# EAGLE design LTC6811_slave_12s_rev2 (EAGLE 9.3.1)
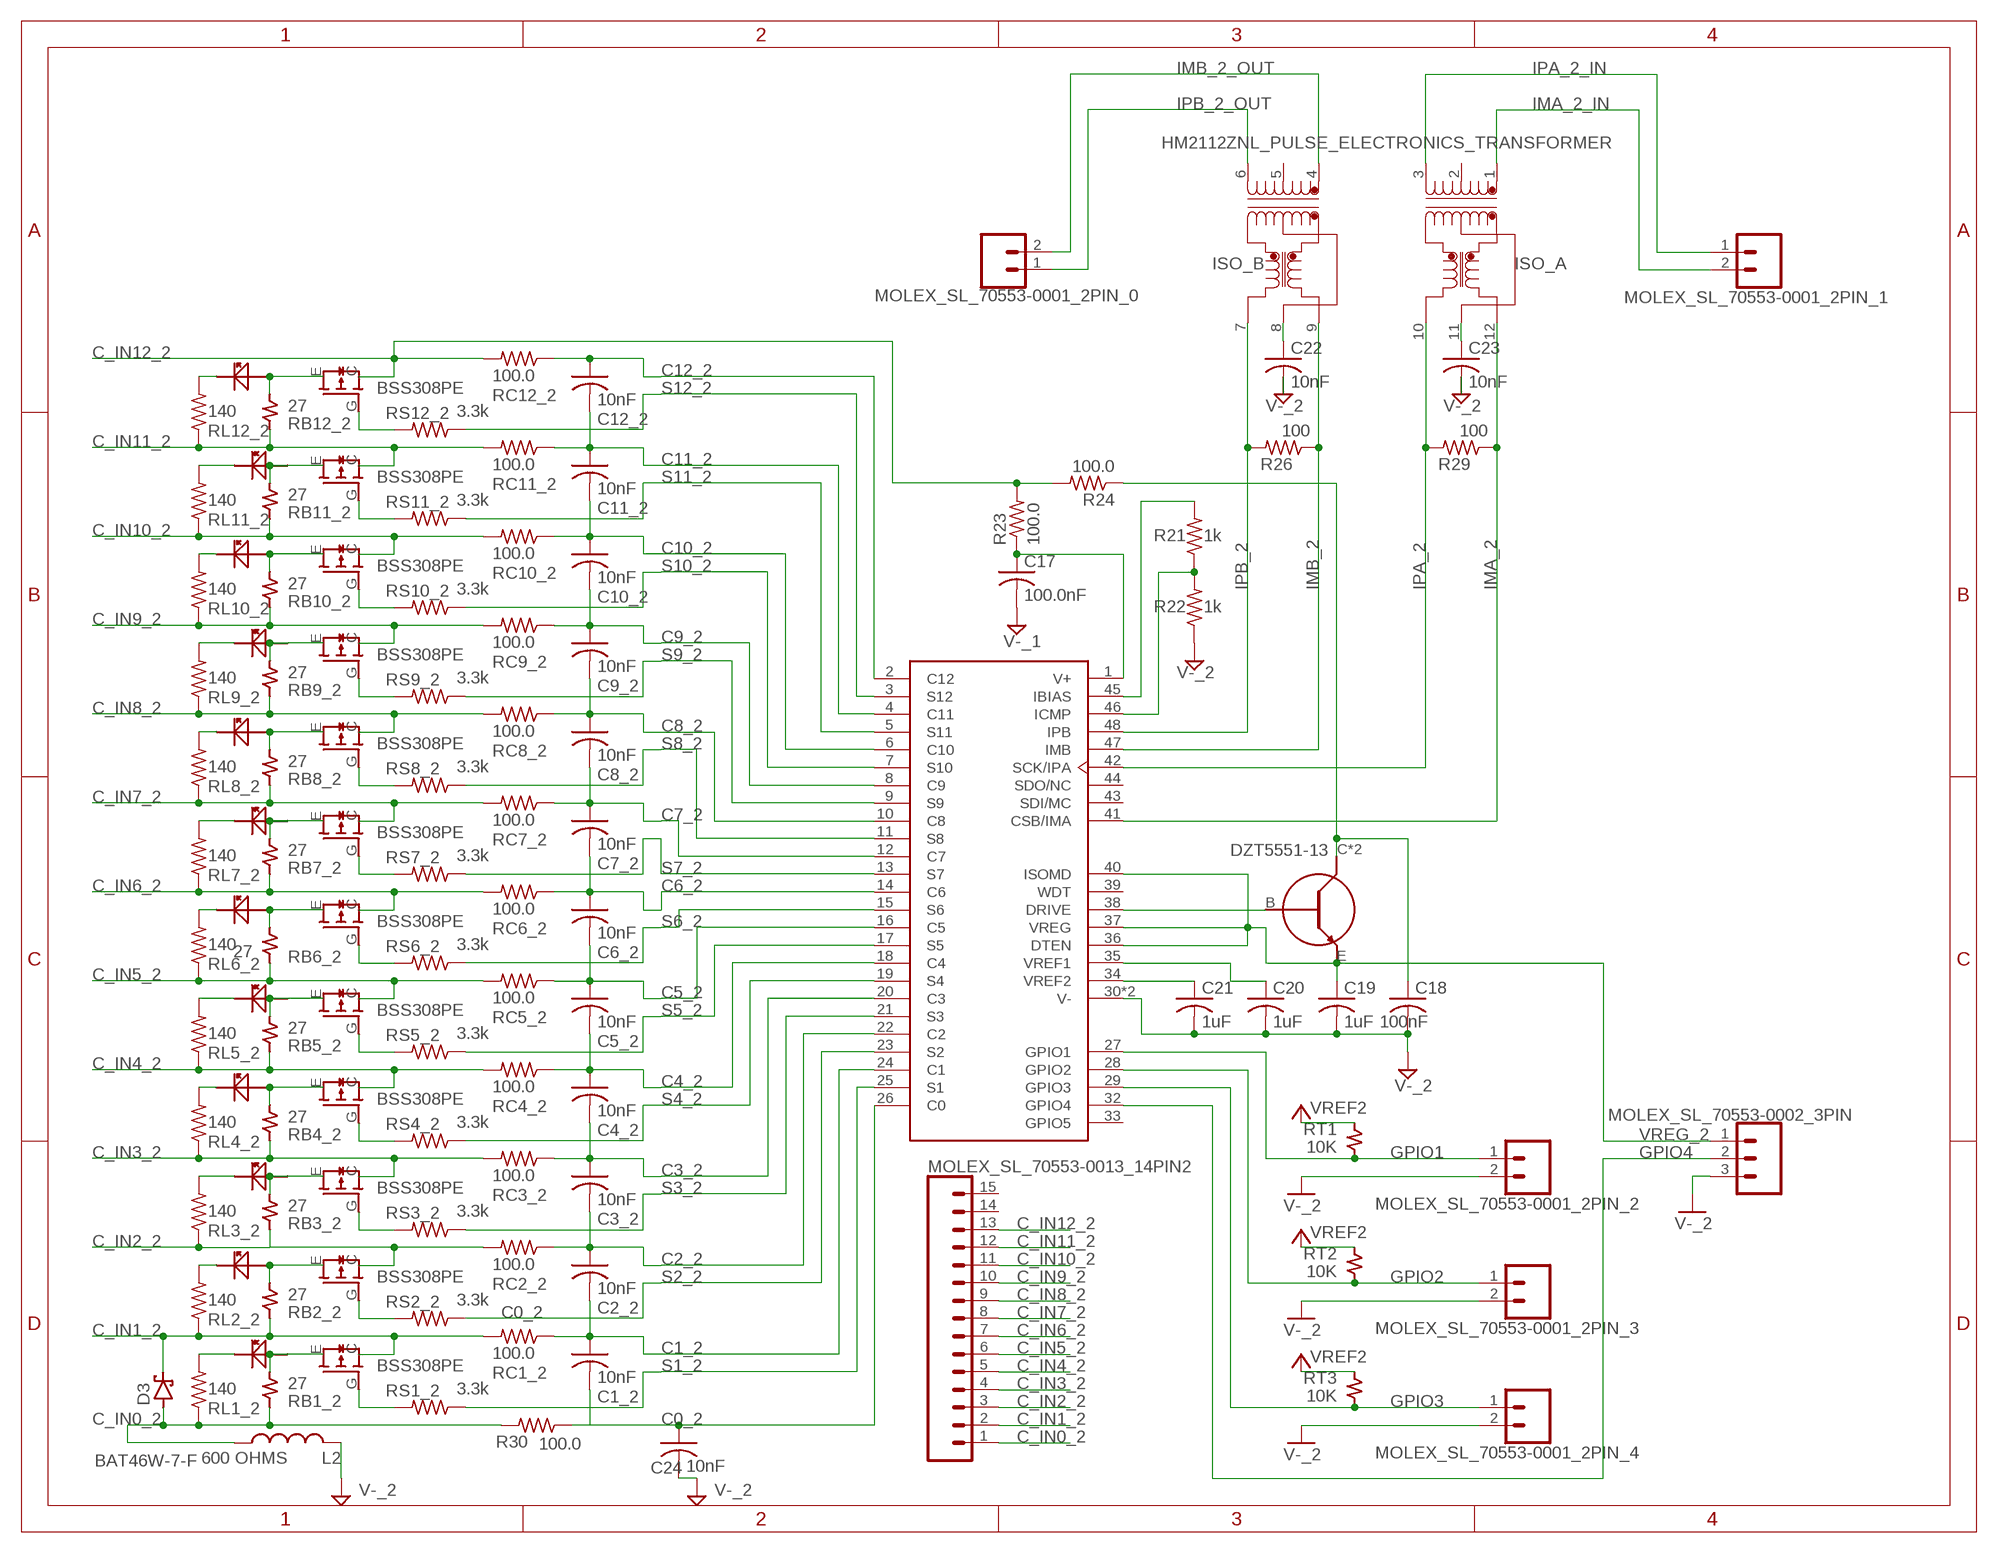
[diagram p0: schematic, sheet 1]

## Parts
C1_2  10nF  C-USC0805  [C0805]
C2_2  10nF  C-USC0805  [C0805]
C3_2  10nF  C-USC0805  [C0805]
C4_2  10nF  C-USC0805  [C0805]
C5_2  10nF  C-USC0805  [C0805]
C6_2  10nF  C-USC0805  [C0805]
C7_2  10nF  C-USC0805  [C0805]
C8_2  10nF  C-USC0805  [C0805]
C9_2  10nF  C-USC0805  [C0805]
C10_2  10nF  C-USC0805  [C0805]
C11_2  10nF  C-USC0805  [C0805]
C12_2  10nF  C-USC0805  [C0805]
C17  100.0nF  C-USC0805  [C0805]
C18  100nF  C-USC0805  [C0805]
C19  1uF  C-USC0805  [C0805]
C20  1uF  C-USC0805  [C0805]
C21  1uF  C-USC0805  [C0805]
C22  10nF  C-USC0805  [C0805]
C23  10nF  C-USC0805  [C0805]
C24  10nF  C-USC0805  [C0805]
D3  BAT46W-7-F  [SOD123]
DZT5551-2  DZT5551-13  [SOT223-4]
L2  600 OHMS  0805_FERRITEBEAD_INDUCTOR  [0805_COMPONENT]
LED1_25  LED_0805  [0805_COMPONENT]
LED1_26  LED_0805  [0805_COMPONENT]
LED1_27  LED_0805  [0805_COMPONENT]
LED1_28  LED_0805  [0805_COMPONENT]
LED1_29  LED_0805  [0805_COMPONENT]
LED1_30  LED_0805  [0805_COMPONENT]
LED1_31  LED_0805  [0805_COMPONENT]
LED1_32  LED_0805  [0805_COMPONENT]
LED1_33  LED_0805  [0805_COMPONENT]
LED1_34  LED_0805  [0805_COMPONENT]
LED1_35  LED_0805  [0805_COMPONENT]
LED1_36  LED_0805  [0805_COMPONENT]
MOLEX_SL_70553-0001_2PIN_0  CONN_02  [1X02]
MOLEX_SL_70553-0001_2PIN_1  CONN_02  [1X02]
MOLEX_SL_70553-0001_2PIN_2  CONN_02  [1X02]
MOLEX_SL_70553-0001_2PIN_3  CONN_02  [1X02]
MOLEX_SL_70553-0001_2PIN_4  CONN_02  [1X02]
MOLEX_SL_70553-0002_3PIN  CONN_03  [1X03]
MOLEX_SL_70553-0013_14PIN2  CONN_15  [1X15]
R21  1k  R-US_R0805  [R0805]
R22  1k  R-US_R0805  [R0805]
R23  100.0  R-US_R0805  [R0805]
R24  100.0  R-US_R0805  [R0805]
R26  100  R-US_R0805  [R0805]
R29  100  R-US_R0805  [R0805]
R30  100.0  R-US_R0805  [R0805]
RB1_2  27  2817_RESISTOR  [2817_COMPONENT]
RB2_2  27  2817_RESISTOR  [2817_COMPONENT]
RB3_2  27  2817_RESISTOR  [2817_COMPONENT]
RB4_2  27  2817_RESISTOR  [2817_COMPONENT]
RB5_2  27  2817_RESISTOR  [2817_COMPONENT]
RB6_2  27  2817_RESISTOR  [2817_COMPONENT]
RB7_2  27  2817_RESISTOR  [2817_COMPONENT]
RB8_2  27  2817_RESISTOR  [2817_COMPONENT]
RB9_2  27  2817_RESISTOR  [2817_COMPONENT]
RB10_2  27  2817_RESISTOR  [2817_COMPONENT]
RB11_2  27  2817_RESISTOR  [2817_COMPONENT]
RB12_2  27  2817_RESISTOR  [2817_COMPONENT]
RC1_2  100.0  R-US_R0805  [R0805]
RC2_2  100.0  R-US_R0805  [R0805]
RC3_2  100.0  R-US_R0805  [R0805]
RC4_2  100.0  R-US_R0805  [R0805]
RC5_2  100.0  R-US_R0805  [R0805]
RC6_2  100.0  R-US_R0805  [R0805]
RC7_2  100.0  R-US_R0805  [R0805]
RC8_2  100.0  R-US_R0805  [R0805]
RC9_2  100.0  R-US_R0805  [R0805]
RC10_2  100.0  R-US_R0805  [R0805]
RC11_2  100.0  R-US_R0805  [R0805]
RC12_2  100.0  R-US_R0805  [R0805]
RL1_2  140  R-US_R0805  [R0805]
RL2_2  140  R-US_R0805  [R0805]
RL3_2  140  R-US_R0805  [R0805]
RL4_2  140  R-US_R0805  [R0805]
RL5_2  140  R-US_R0805  [R0805]
RL6_2  140  R-US_R0805  [R0805]
RL7_2  140  R-US_R0805  [R0805]
RL8_2  140  R-US_R0805  [R0805]
RL9_2  140  R-US_R0805  [R0805]
RL10_2  140  R-US_R0805  [R0805]
RL11_2  140  R-US_R0805  [R0805]
RL12_2  140  R-US_R0805  [R0805]
RS1_2  3.3k  R-US_R0805  [R0805]
RS2_2  3.3k  R-US_R0805  [R0805]
RS3_2  3.3k  R-US_R0805  [R0805]
RS4_2  3.3k  R-US_R0805  [R0805]
RS5_2  3.3k  R-US_R0805  [R0805]
RS6_2  3.3k  R-US_R0805  [R0805]
RS7_2  3.3k  R-US_R0805  [R0805]
RS8_2  3.3k  R-US_R0805  [R0805]
RS9_2  3.3k  R-US_R0805  [R0805]
RS10_2  3.3k  R-US_R0805  [R0805]
RS11_2  3.3k  R-US_R0805  [R0805]
RS12_2  3.3k  R-US_R0805  [R0805]
RT1  10K  0805_RESISTOR  [0805_RESISTOR]
RT2  10K  0805_RESISTOR  [0805_RESISTOR]
RT3  10K  0805_RESISTOR  [0805_RESISTOR]
T1_25  BSS308PEH6327  [SOT23]
T1_26  BSS308PEH6327  [SOT23]
T1_27  BSS308PEH6327  [SOT23]
T1_28  BSS308PEH6327  [SOT23]
T1_29  BSS308PEH6327  [SOT23]
T1_30  BSS308PEH6327  [SOT23]
T1_31  BSS308PEH6327  [SOT23]
T1_32  BSS308PEH6327  [SOT23]
T1_33  BSS308PEH6327  [SOT23]
T1_34  BSS308PEH6327  [SOT23]
T1_35  BSS308PEH6327  [SOT23]
T1_36  BSS308PEH6327  [SOT23]
U3  LTC6811HG-2#PBF  [LTC6811-1]
U$3  HM2112ZNL_PULSE_ELECTRONICS_TRANSFORMER  [HM2112ZNL_12SMT]

## Nets
C0_2: C24.1 R30.1 U3.26(C0)
C1_2: C1_2.1 C2_2.2 RC1_2.1 U3.24(C1)
C2_2: C2_2.1 C3_2.2 RC2_2.1 U3.22(C2)
C3_2: C3_2.1 C4_2.2 RC3_2.1 U3.20(C3)
C4_2: C4_2.1 C5_2.2 RC4_2.1 U3.18(C4)
C5_2: C5_2.1 C6_2.2 RC5_2.1 U3.16(C5)
C6_2: C6_2.1 C7_2.2 RC6_2.1 U3.14(C6)
C7_2: C7_2.1 C8_2.2 RC7_2.1 U3.12(C7)
C8_2: C8_2.1 C9_2.2 RC8_2.1 U3.10(C8)
C9_2: C9_2.1 C10_2.2 RC9_2.1 U3.8(C9)
C10_2: C10_2.1 C11_2.2 RC10_2.1 U3.6(C10)
C11_2: C11_2.1 C12_2.2 RC11_2.1 U3.4(C11)
C12_2: C12_2.1 RC12_2.1 U3.2(C12)
C_IN0_2: D3.A L2.1 MOLEX_SL_70553-0013_14PIN2.1 R30.2 RB1_2.2 RL1_2.1
C_IN1_2: D3.C MOLEX_SL_70553-0013_14PIN2.2 RB2_2.2 RC1_2.2 RL2_2.1 T1_25.C
C_IN2_2: MOLEX_SL_70553-0013_14PIN2.3 RB3_2.2 RC2_2.2 RL3_2.1 T1_26.C
C_IN3_2: MOLEX_SL_70553-0013_14PIN2.4 RB4_2.2 RC3_2.2 RL4_2.1 T1_27.C
C_IN4_2: MOLEX_SL_70553-0013_14PIN2.5 RB5_2.2 RC4_2.2 RL5_2.1 T1_28.C
C_IN5_2: MOLEX_SL_70553-0013_14PIN2.6 RB6_2.2 RC5_2.2 RL6_2.1 T1_29.C
C_IN6_2: MOLEX_SL_70553-0013_14PIN2.7 RB7_2.2 RC6_2.2 RL7_2.1 T1_30.C
C_IN7_2: MOLEX_SL_70553-0013_14PIN2.8 RB8_2.2 RC7_2.2 RL8_2.1 T1_31.C
C_IN8_2: MOLEX_SL_70553-0013_14PIN2.9 RB9_2.2 RC8_2.2 RL9_2.1 T1_32.C
C_IN9_2: MOLEX_SL_70553-0013_14PIN2.10 RB10_2.2 RC9_2.2 RL10_2.1 T1_33.C
C_IN10_2: MOLEX_SL_70553-0013_14PIN2.11 RB11_2.2 RC10_2.2 RL11_2.1 T1_34.C
C_IN11_2: MOLEX_SL_70553-0013_14PIN2.12 RB12_2.2 RC11_2.2 RL12_2.1 T1_35.C
C_IN12_2: MOLEX_SL_70553-0013_14PIN2.13 R23.2 R24.2 RC12_2.2 T1_36.C
DRIVE_2: DZT5551-2.B U3.38(DRIVE)
GPIO1: MOLEX_SL_70553-0001_2PIN_2.1 RT1.P$2 U3.27(GPIO1)
GPIO2: MOLEX_SL_70553-0001_2PIN_3.1 RT2.P$2 U3.28(GPIO2)
GPIO3: MOLEX_SL_70553-0001_2PIN_4.1 RT3.P$2 U3.29(GPIO3)
GPIO4: MOLEX_SL_70553-0002_3PIN.2 U3.32(GPIO4)
IBIAS_2: R21.2 U3.45(IBIAS)
ICMP_2: R21.1 R22.2 U3.46(ICMP)
IMA_2: R29.1 U3.41(CSB/IMA) U$3.12
IMA_2_IN: MOLEX_SL_70553-0001_2PIN_1.2 U$3.1
IMB_2: R26.1 U3.47(IMB) U$3.9
IMB_2_OUT: MOLEX_SL_70553-0001_2PIN_0.2 U$3.4
IPA_2: R29.2 U3.42(SCK/IPA) U$3.10
IPA_2_IN: MOLEX_SL_70553-0001_2PIN_1.1 U$3.3
IPB_2: R26.2 U3.48(IPB) U$3.7
IPB_2_OUT: MOLEX_SL_70553-0001_2PIN_0.1 U$3.6
N$85: C17.1 R23.1 U3.1(V+)
N$86: C22.1 U$3.8
N$89: C23.1 U$3.11
N$90: LED1_25.2 RB1_2.1 T1_25.E
N$91: RS1_2.2 T1_25.G(B)
N$92: LED1_25.1 RL1_2.2
N$93: LED1_26.2 RB2_2.1 T1_26.E
N$94: RS2_2.2 T1_26.G(B)
N$95: LED1_26.1 RL2_2.2
N$96: C1_2.2
N$97: LED1_27.2 RB3_2.1 T1_27.E
N$98: RS3_2.2 T1_27.G(B)
N$99: LED1_27.1 RL3_2.2
N$100: LED1_28.2 RB4_2.1 T1_28.E
N$101: RS4_2.2 T1_28.G(B)
N$102: LED1_28.1 RL4_2.2
N$103: LED1_29.2 RB5_2.1 T1_29.E
N$104: RS5_2.2 T1_29.G(B)
N$105: LED1_29.1 RL5_2.2
N$106: LED1_30.2 RB6_2.1 T1_30.E
N$107: RS6_2.2 T1_30.G(B)
N$108: LED1_30.1 RL6_2.2
N$109: LED1_31.2 RB7_2.1 T1_31.E
N$110: RS7_2.2 T1_31.G(B)
N$111: LED1_31.1 RL7_2.2
N$112: LED1_32.2 RB8_2.1 T1_32.E
N$113: RS8_2.2 T1_32.G(B)
N$114: LED1_32.1 RL8_2.2
N$115: LED1_33.2 RB9_2.1 T1_33.E
N$116: RS9_2.2 T1_33.G(B)
N$117: LED1_33.1 RL9_2.2
N$118: LED1_34.2 RB10_2.1 T1_34.E
N$119: RS10_2.2 T1_34.G(B)
N$120: LED1_34.1 RL10_2.2
N$121: LED1_35.2 RB11_2.1 T1_35.E
N$122: RS11_2.2 T1_35.G(B)
N$123: LED1_35.1 RL11_2.2
N$124: LED1_36.2 RB12_2.1 T1_36.E
N$125: RS12_2.2 T1_36.G(B)
N$126: LED1_36.1 RL12_2.2
S1_2: RS1_2.1 U3.25(S1)
S2_2: RS2_2.1 U3.23(S2)
S3_2: RS3_2.1 U3.21(S3)
S4_2: RS4_2.1 U3.19(S4)
S5_2: RS5_2.1 U3.17(S5)
S6_2: RS6_2.1 U3.15(S6)
S7_2: RS7_2.1 U3.13(S7)
S8_2: RS8_2.1 U3.11(S8)
S9_2: RS9_2.1 U3.9(S9)
S10_2: RS10_2.1 U3.7(S10)
S11_2: RS11_2.1 U3.5(S11)
S12_2: RS12_2.1 U3.3(S12)
V-_2: C17.2 C18.2 C19.2 C20.2 C21.2 C22.2 C23.2 C24.2 L2.2 MOLEX_SL_70553-0001_2PIN_2.2 MOLEX_SL_70553-0001_2PIN_3.2 MOLEX_SL_70553-0001_2PIN_4.2 MOLEX_SL_70553-0002_3PIN.3 R22.1 U3.30(V-) U3.31(V-) ; supply symbol labelled V-_1, GND
VREF1_C4_2: C20.1 U3.35(VREF1)
VREF2_C5_2: C21.1 RT1.P$1 RT2.P$1 RT3.P$1 U3.34(VREF2) ; supply symbol labelled VREF2
VREG_2: C19.1 DZT5551-2.E MOLEX_SL_70553-0002_3PIN.1 U3.36(DTEN) U3.37(VREG) U3.40(ISOMD)
VREG_CAP_2: C18.1 DZT5551-2.C DZT5551-2.C@2(C) R24.1
Unconnected: MOLEX_SL_70553-0013_14PIN2.14 MOLEX_SL_70553-0013_14PIN2.15 U3.33(GPIO5) U3.39(WDT) U3.43(SDI/MC) U3.44(SDO/NC) U$3.2 U$3.5

## Notes on the sheet
- ISO_B | ISO_A
- DZT5551-13

## Library data of the parts
C1_2 C2_2 C3_2 C4_2 C5_2 C6_2 C7_2 C8_2 C9_2 C10_2 C11_2 C12_2 C17-C24 = resistor:C-US: CAPACITOR, American symbol
D3 = Library_Capstone:BAT46W-7-F
DZT5551-2 = Library_Capstone:DZT5551-13
L2 = Library_Capstone:0805_FERRITEBEAD_INDUCTOR
LED1_25-LED1_36 = Library_Capstone:LED_0805
MOLEX_SL_70553-0001_2PIN_0 MOLEX_SL_70553-0001_2PIN_1-MOLEX_SL_70553-0001_2PIN_4 = SparkFun-Connectors:CONN_02: Multi connection point. Often used as Generic Header-pin footprint for 0.1 inch spaced/style header connections On any of the 0.1 inch spaced packages, you can populate with these: Break Away Headers - Straight <https://www.sparkfun.com/products/116> (PRT-00116) Break Away Male Headers - Right Angle <https://www.sparkfun.com/products/553> (PRT-00553) Female Headers <https://www.sparkfun.com/products/115> (PRT-00115) Break Away Headers - Machine Pin <https://www.sparkfun.com/products/117> (PRT-00117) Break Away Female Headers - Swiss Machine Pin <https://www.sparkfun.com/products/743> (PRT-00743) For SCREWTERMINALS and SPRING TERMINALS visit here: Screw Terimnals on SparkFun.com <https://www.sparkfun.com/search/results?term=Screw+Terminals> (5mm/3.5mm/2.54mm spacing) This device is also useful as a general connection point to wire up your design to another part of your project. Our various solder wires solder well into these plated through hole pads. Hook-Up Wire - Assortment (Stranded, 22 AWG) <https://www.sparkfun.com/products/11375> (PRT-11375) Hook-Up Wire - Assortment (Solid Core, 22 AWG) <https://www.sparkfun.com/products/11367> (PRT-11367) View the entire wire category on our website here <https://www.sparkfun.com/categories/141> Special notes: Molex polarized connector foot print use with: PRT-08233 with associated crimp pins and housings. 2.54_SCREWTERM for use with PRT-10571. 3.5mm Screw Terminal footprints for PRT-08084 5mm Screw Terminal footprints for use with PRT-08432
MOLEX_SL_70553-0002_3PIN = SparkFun-Connectors:CONN_03: Multi connection point. Often used as Generic Header-pin footprint for 0.1 inch spaced/style header connections On any of the 0.1 inch spaced packages, you can populate with these: Break Away Headers - Straight <https://www.sparkfun.com/products/116> (PRT-00116) Break Away Male Headers - Right Angle <https://www.sparkfun.com/products/553> (PRT-00553) Female Headers <https://www.sparkfun.com/products/115> (PRT-00115) Break Away Headers - Machine Pin <https://www.sparkfun.com/products/117> (PRT-00117) Break Away Female Headers - Swiss Machine Pin <https://www.sparkfun.com/products/743> (PRT-00743) Stackable Header - 3 Pin (Female, 0.1") <https://www.sparkfun.com/products/13875> (PRT-13875) For SCREWTERMINALS and SPRING TERMINALS visit here: Screw Terimnals on SparkFun.com <https://www.sparkfun.com/search/results?term=Screw+Terminals> (5mm/3.5mm/2.54mm spacing) This device is also useful as a general connection point to wire up your design to another part of your project. Our various solder wires solder well into these plated through hole pads. Hook-Up Wire - Assortment (Stranded, 22 AWG) <https://www.sparkfun.com/products/11375> (PRT-11375) Hook-Up Wire - Assortment (Solid Core, 22 AWG) <https://www.sparkfun.com/products/11367> (PRT-11367) View the entire wire category on our website here <https://www.sparkfun.com/categories/141> Special notes: Molex polarized connector foot print use with SKU : PRT-08232 with associated crimp pins and housings.
MOLEX_SL_70553-0013_14PIN2 = SparkFun-Connectors:CONN_15: Multi connection point. Often used as Generic Header-pin footprint for 0.1 inch spaced/style header connections On any of the 0.1 inch spaced packages, you can populate with these: Break Away Headers - Straight <https://www.sparkfun.com/products/116> (PRT-00116) Break Away Male Headers - Right Angle <https://www.sparkfun.com/products/553> (PRT-00553) Female Headers <https://www.sparkfun.com/products/115> (PRT-00115) Break Away Headers - Machine Pin <https://www.sparkfun.com/products/117> (PRT-00117) Break Away Female Headers - Swiss Machine Pin <https://www.sparkfun.com/products/743> (PRT-00743) For SCREWTERMINALS and SPRING TERMINALS visit here: Screw Terimnals on SparkFun.com <https://www.sparkfun.com/search/results?term=Screw+Terminals> (5mm/3.5mm/2.54mm spacing) This device is also useful as a general connection point to wire up your design to another part of your project. Our various solder wires solder well into these plated through hole pads. Hook-Up Wire - Assortment (Stranded, 22 AWG) <https://www.sparkfun.com/products/11375> (PRT-11375) Hook-Up Wire - Assortment (Solid Core, 22 AWG) <https://www.sparkfun.com/products/11367> (PRT-11367) View the entire wire category on our website here <https://www.sparkfun.com/categories/141> Special notes: Molex polarized connector foot print use with SKU : PRT-08231 with associated crimp pins and housings. 1MM SMD Version SKU: PRT-10208 NOTES ON THE VARIANTS LOCK and LOCK_LONGPADS... This footprint was designed to help hold the alignment of a through-hole component (i.e. 6-pin header) while soldering it into place. You may notice that each hole has been shifted either up or down by 0.005 of an inch from it's more standard position (which is a perfectly straight line). This slight alteration caused the pins (the squares in the middle) to touch the edges of the holes. Because they are alternating, it causes a "brace" to hold the component in place. 0.005 has proven to be the perfect amount of "off-center" position when using our standard breakaway headers. Although looks a little odd when you look at the bare footprint, once you have a header in there, the alteration is very hard to notice. Also,if you push a header all the way into place, it is covered up entirely on the bottom side.
R21-R24 R26 R29 R30 RC1_2 RC2_2 RC3_2 RC4_2 RC5_2 RC6_2 RC7_2 RC8_2 RC9_2 RC10_2 RC11_2 RC12_2 RL1_2 RL2_2 RL3_2 RL4_2 RL5_2 RL6_2 RL7_2 RL8_2 RL9_2 RL10_2 RL11_2 RL12_2 RS1_2 RS2_2 RS3_2 RS4_2 RS5_2 RS6_2 RS7_2 RS8_2 RS9_2 RS10_2 RS11_2 RS12_2 = resistor:R-US_: RESISTOR, American symbol
RB1_2 RB2_2 RB3_2 RB4_2 RB5_2 RB6_2 RB7_2 RB8_2 RB9_2 RB10_2 RB11_2 RB12_2 = Library_Capstone:2817_RESISTOR
RT1-RT3 = Library_Capstone:0805_RESISTOR
T1_25-T1_36 = Library_Capstone:BSS308PEH6327
U3 = LTC6811HG-2_PBF:LTC6811HG-2#PBF: LTC6811-1/LTC6811-2 - Multicell Battery Monitors; AVAILABILITY: Unavailable; DESCRIPTION: LTC6811-1/LTC6811-2 - Multicell Battery Monitors; MF: Linear Technology/Analog; MP: LTC6811HG-2#PBF; PACKAGE: SSOP-48 Linear Technology; PRICE: None
U$3 = HM2112ZNL:HM2112ZNL_PULSE_ELECTRONICS_TRANSFORMER

## Board
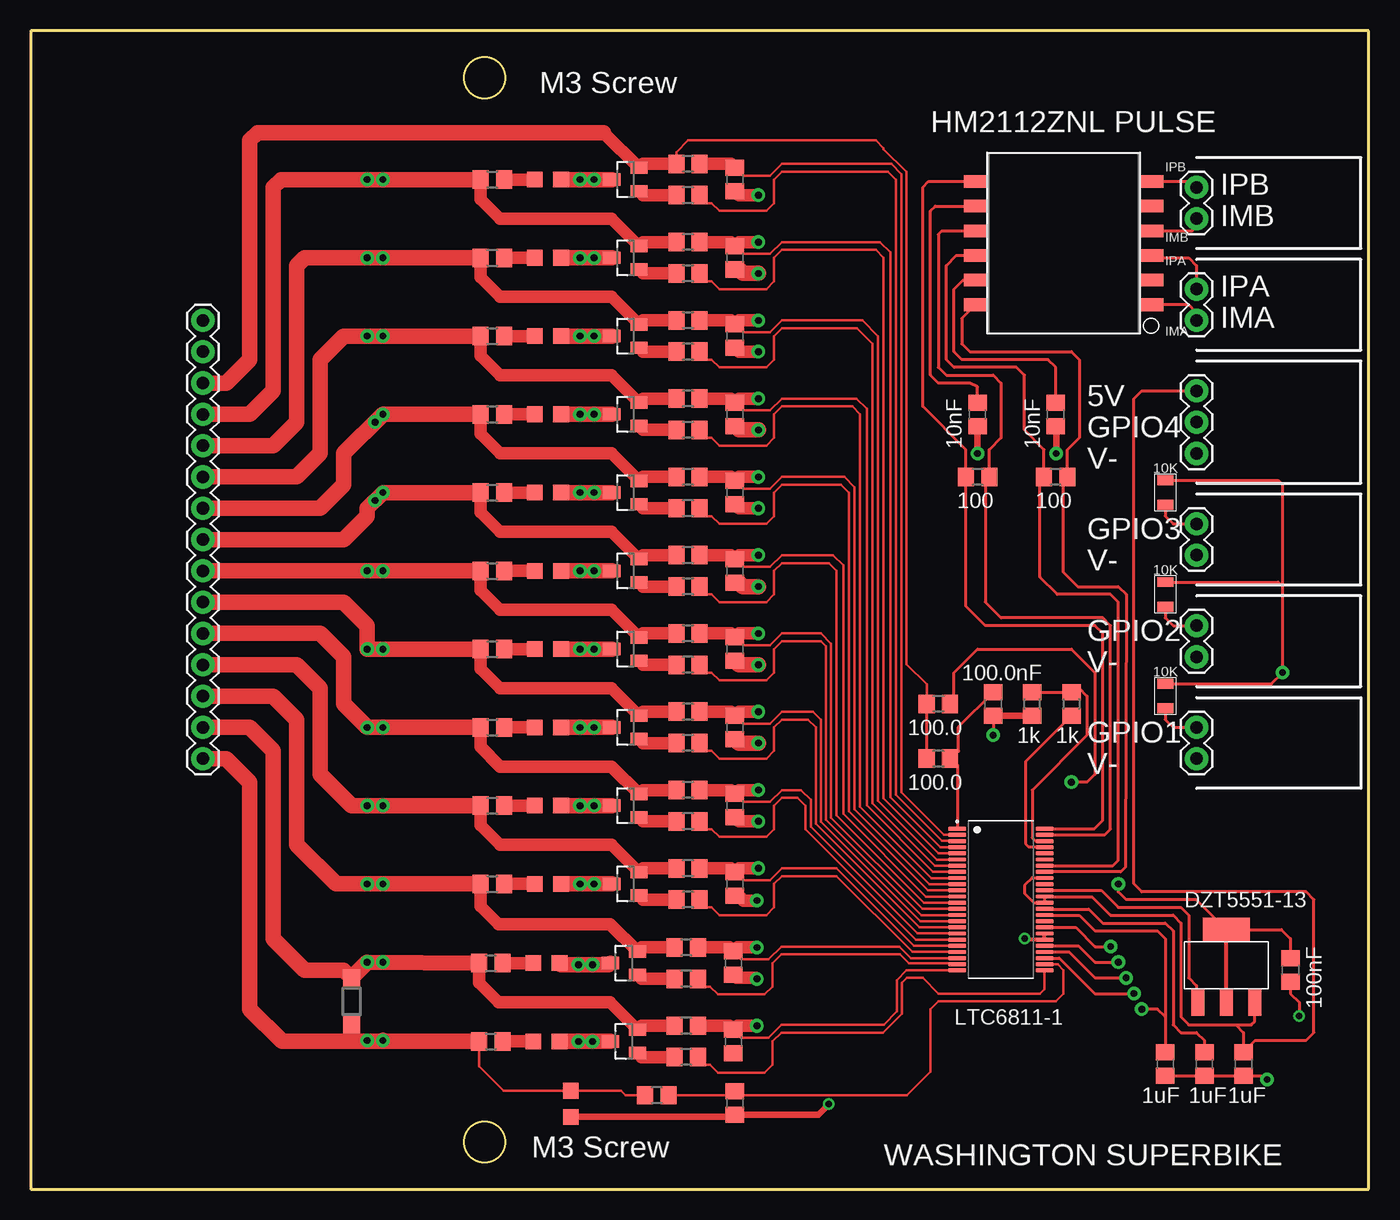
[diagram p1: board, top side]
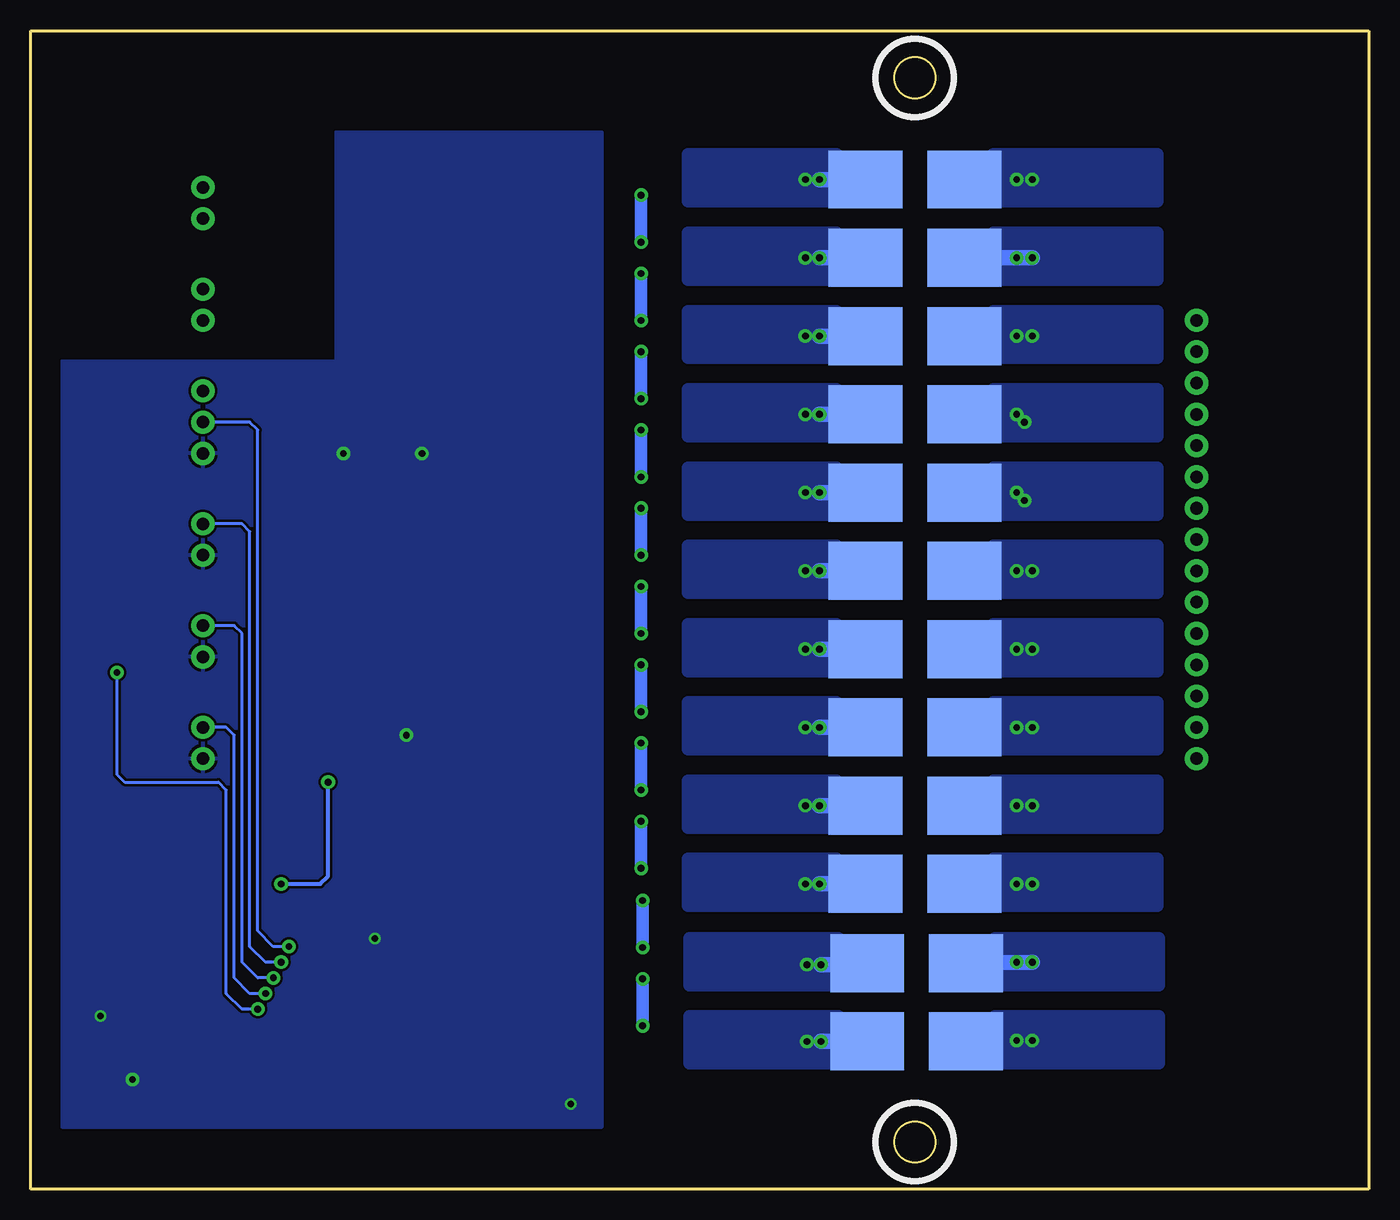
[diagram p2: board, bottom side, seen from below]

Size 108.58 x 93.98 mm. Coordinates in mm from the lower left corner, seen from the top.
Outline: 0,0 108.58,0 108.58,93.98 0,93.98 0,0
Outline: circle at 36.83,90.17 radius 1.65
Outline: circle at 36.83,3.81 radius 1.65
Copper layers (1*16): Top 0.035mm / dielectric 1.5mm / Bottom 0.035mm
Design rules "default *": minimum track width 6mil, minimum drill 0.53mm, track to track 8mil, track to pad 6mil, pad to pad 6mil, via to via 6mil, smd to smd 6mil, copper to edge 40mil, drill to drill 6mil, minimum pad ring 10mil, minimum via ring 8mil, stop-mask expansion 4mil, vias tented up to drill 0mil, thermal gap 10mil

### Footprints (pad centres in the part's own frame; a part is rotated, then mirrored left to right if it is on the bottom)
C0805 = smd 1.3 x 1.5: 1 -0.95,0; 2 0.95,0
SOD123 = smd 1.4 x 1.4: A 1.9,0; C -1.9,0
SOT223-4 = smd 1.067 x 2.184: B -2.3,-3; C@2 0,-3; E 2.3,-3 | smd 3.81 x 1.93: C 0,2.9
0805_COMPONENT = smd 1.27 x 1.27: 1 -1,0; 2 1.127,0
1X02 = drill 1.016 pad 1.88: 1 0,0; 2 2.54,0
1X03 = drill 1.016 pad 1.88: 1 0,0; 2 2.54,0; 3 5.08,0
1X15 = drill 1.016 pad 1.88: 1 0,0; 2 2.54,0; 3 5.08,0; 4 7.62,0; 5 10.16,0; 6 12.7,0; 7 15.24,0; 8 17.78,0; 9 20.32,0; 10 22.86,0; 11 25.4,0; 12 27.94,0; 13 30.48,0; 14 33.02,0; 15 35.56,0
R0805 = smd 1.3 x 1.5: 1 -0.95,0; 2 0.95,0
2817_COMPONENT = smd 6 x 4.7: 1 -4,0; 2 4,0
0805_RESISTOR = smd 0.8 x 1.27: P$1 -1,0; P$2 1,0
SOT23 = smd 1 x 1.4: C 0.95,-1.1; E 0,1.1; G -0.95,-1.1
LTC6811-1 = smd 1.44 x 0.34: 1 -3.54,5.75; 2 -3.54,5.25; 3 -3.54,4.75; 4 -3.54,4.25; 5 -3.54,3.75; 6 -3.54,3.25; 7 -3.54,2.75; 8 -3.54,2.25; 9 -3.54,1.75; 10 -3.54,1.25; 11 -3.54,0.75; 12 -3.54,0.25; 13 -3.54,-0.25; 14 -3.54,-0.75; 15 -3.54,-1.25; 16 -3.54,-1.75; 17 -3.54,-2.25; 18 -3.54,-2.75; 19 -3.54,-3.25; 20 -3.54,-3.75; 21 -3.54,-4.25; 22 -3.54,-4.75; 23 -3.54,-5.25; 24 -3.54,-5.75; 25 3.54,-5.75; 26 3.54,-5.25; 27 3.54,-4.75; 28 3.54,-4.25; 29 3.54,-3.75; 30 3.54,-3.25; 31 3.54,-2.75; 32 3.54,-2.25; 33 3.54,-1.75; 34 3.54,-1.25; 35 3.54,-0.75; 36 3.54,-0.25; 37 3.54,0.25; 38 3.54,0.75; 39 3.54,1.25; 40 3.54,1.75; 41 3.54,2.25; 42 3.54,2.75; 43 3.54,3.25; 44 3.54,3.75; 45 3.54,4.25; 46 3.54,4.75; 47 3.54,5.25; 48 3.54,5.75
HM2112ZNL_12SMT = smd 1.02 x 1.89: 1 0,-7.145; 2 2,-7.145; 3 4,-7.145; 4 6,-7.145; 5 8,-7.145; 6 10,-7.145; 7 10,7.145; 8 8,7.145; 9 6,7.145; 10 4,7.145; 11 2,7.145; 12 0,7.145

### Placement (x,y rotation side)
C1_2  57.02,11.99 270 top
C2_2  57.02,18.34 270 top
C3_2  57.15,24.77 270 top
C4_2  57.15,31.11 270 top
C5_2  57.15,37.47 270 top
C6_2  57.15,43.81 270 top
C7_2  57.15,50.16 270 top
C8_2  57.15,56.52 270 top
C9_2  57.15,62.87 270 top
C10_2  57.15,69.22 270 top
C11_2  57.15,75.56 270 top
C12_2  57.15,81.92 270 top
C17  78.11,39.37 270 top
C18  102.23,17.78 270 top
C19  98.42,10.16 270 top
C20  95.25,10.16 270 top
C21  92.08,10.16 270 top
C22  76.83,62.87 270 top
C23  83.19,62.87 270 top
C24  57.15,6.99 270 top
D3  26.04,15.24 270 top
DZT5551-2  97.03,18.16 0 top
L2  43.81,6.99 270 top
LED1_25  41.78,11.99 0 top
LED1_26  41.78,18.34 0 top
LED1_27  41.91,24.77 0 top
LED1_28  41.91,31.11 0 top
LED1_29  41.91,37.47 0 top
LED1_30  41.91,43.81 0 top
LED1_31  41.91,50.16 0 top
LED1_32  41.91,56.52 0 top
LED1_33  41.91,62.87 0 top
LED1_34  41.91,69.22 0 top
LED1_35  41.91,75.56 0 top
LED1_36  41.91,81.92 0 top
MOLEX_SL_70553-0001_2PIN_0  94.61,81.28 270 top
MOLEX_SL_70553-0001_2PIN_1  94.61,73.03 270 top
MOLEX_SL_70553-0001_2PIN_2  94.61,37.47 270 top
MOLEX_SL_70553-0001_2PIN_3  94.61,45.72 270 top
MOLEX_SL_70553-0001_2PIN_4  94.61,53.98 270 top
MOLEX_SL_70553-0002_3PIN  94.61,64.77 270 top
MOLEX_SL_70553-0013_14PIN2  13.97,34.92 90 top
R21  84.45,39.37 270 top
R22  81.28,39.37 90 top
R23  73.66,34.92 180 top
R24  73.66,39.37 180 top
R26  76.83,57.78 180 top
R29  83.19,57.78 180 top
R30  50.8,7.62 180 top
RB1_2  36.7,11.99 0 bottom
RB2_2  36.7,18.34 0 bottom
RB3_2  36.83,24.77 0 bottom
RB4_2  36.83,31.11 0 bottom
RB5_2  36.83,37.47 0 bottom
RB6_2  36.83,43.81 0 bottom
RB7_2  36.83,50.16 0 bottom
RB8_2  36.83,56.52 0 bottom
RB9_2  36.83,62.87 0 bottom
RB10_2  36.83,69.22 0 bottom
RB11_2  36.83,75.56 0 bottom
RB12_2  36.83,81.92 0 bottom
RC1_2  53.21,13.26 180 top
RC2_2  53.21,19.61 180 top
RC3_2  53.34,26.04 180 top
RC4_2  53.34,32.38 180 top
RC5_2  53.34,38.73 180 top
RC6_2  53.34,45.09 180 top
RC7_2  53.34,51.44 180 top
RC8_2  53.34,57.78 180 top
RC9_2  53.34,64.14 180 top
RC10_2  53.34,70.48 180 top
RC11_2  53.34,76.83 180 top
RC12_2  53.34,83.19 180 top
RL1_2  37.34,11.99 0 top
RL2_2  37.34,18.34 0 top
RL3_2  37.47,24.77 0 top
RL4_2  37.47,31.11 0 top
RL5_2  37.47,37.47 0 top
RL6_2  37.47,43.81 0 top
RL7_2  37.47,50.16 0 top
RL8_2  37.47,56.52 0 top
RL9_2  37.47,62.87 0 top
RL10_2  37.47,69.22 0 top
RL11_2  37.47,75.56 0 top
RL12_2  37.47,81.92 0 top
RS1_2  53.21,10.72 180 top
RS2_2  53.21,17.07 180 top
RS3_2  53.34,23.5 180 top
RS4_2  53.34,29.84 180 top
RS5_2  53.34,36.2 180 top
RS6_2  53.34,42.55 180 top
RS7_2  53.34,48.9 180 top
RS8_2  53.34,55.24 180 top
RS9_2  53.34,61.59 180 top
RS10_2  53.34,67.94 180 top
RS11_2  53.34,74.3 180 top
RS12_2  53.34,80.64 180 top
RT1  92.08,40.01 270 top
RT2  92.08,48.26 270 top
RT3  92.08,56.52 270 top
T1_25  48.13,11.99 90 top
T1_26  48.13,18.34 90 top
T1_27  48.26,24.77 90 top
T1_28  48.26,31.11 90 top
T1_29  48.26,37.47 90 top
T1_30  48.26,43.81 90 top
T1_31  48.26,50.16 90 top
T1_32  48.26,56.52 90 top
T1_33  48.26,62.87 90 top
T1_34  48.26,69.22 90 top
T1_35  48.26,75.56 90 top
T1_36  48.26,81.92 90 top
U3  78.74,23.5 0 top
U$3  83.82,71.75 90 top

### Tracks (layer width: path | path; a pad name or v marks a point on that pad's centre or on a via)
C0_2
  Top 0.203: U3.26 83.36,18.25 83.82,17.78 83.82,15.88 83.19,15.24 73.66,15.24 73.03,14.61 73.03,9.53 71.12,7.62 57.47,7.62 C24.1 56.84,7.62 R30.1
C1_2  (via drill 0.55 pad 1.1)
  Top 0.203: C1_2.1 57.66,12.3 59.88,12.3 60.91,13.34 69.23,13.34 70.31,14.42 70.31,16.97 71.08,17.75 U3.24
  Top 1.016: RC1_2.1 56.7,13.26 C1_2.1 57.34,13.26 v58.93,13.26 | C2_2.2 57.27,17.14 58.85,17.14 v58.93,17.07
  Bottom 1.016: v58.93,13.26 v58.93,17.07
C2_2  (via drill 0.55 pad 1.1)
  Top 0.203: C2_2.1 57.66,18.65 59.88,18.65 60.91,19.68 70.48,19.68 71.42,18.75 U3.22
  Top 1.016: RC2_2.1 56.7,19.61 C2_2.1 57.34,19.61 v58.93,19.61 | C3_2.2 57.47,23.82 57.86,23.42 v58.93,23.42
  Bottom 1.016: v58.93,19.61 v58.93,23.42
C3_2  (via drill 0.55 pad 1.1)
  Top 0.203: C3_2.1 57.78,25.08 60.01,25.08 60.96,26.04 65.41,26.04 71.69,19.75 U3.20
  Top 1.016: RC3_2.1 56.83,26.04 C3_2.1 57.47,26.04 v59.05,26.04 | C4_2.2 57.47,29.84 v59.05,29.84
  Bottom 1.016: v59.05,26.04 v59.05,29.84
C4_2  (via drill 0.55 pad 1.1)
  Top 0.203: C4_2.1 57.78,31.43 60.01,31.43 60.96,32.38 62.52,32.38 63.32,31.58 63.32,29.39 71.97,20.75 U3.18
  Top 1.016: RC4_2.1 56.83,32.38 C4_2.1 57.47,32.38 v59.05,32.38
  Top 1.27: C5_2.2 57.47,36.2 v59.05,36.2
  Bottom 1.016: v59.05,32.38 v59.05,36.2
C5_2  (via drill 0.55 pad 1.1)
  Top 0.203: C5_2.1 57.78,37.78 60.01,37.78 60.96,38.73 63.5,38.73 64.14,38.1 64.14,29.82 72.2,21.75 U3.16
  Top 1.016: RC5_2.1 56.83,38.73 C5_2.1 57.47,38.73 v59.05,38.73
  Top 1.27: C6_2.2 57.47,42.55 v59.05,42.55
  Bottom 1.016: v59.05,38.73 v59.05,42.55
C6_2  (via drill 0.55 pad 1.1)
  Top 0.203: C6_2.1 57.78,44.13 60.01,44.13 60.96,45.09 64.12,45.09 64.95,44.26 64.95,30.15 72.35,22.75 U3.14
  Top 1.016: RC6_2.1 56.83,45.09 C6_2.1 57.47,45.09 v59.05,45.09
  Top 1.27: C7_2.2 57.47,49.22 57.78,48.9 v59.05,48.9
  Bottom 1.016: v59.05,45.09 v59.05,48.9
C7_2  (via drill 0.55 pad 1.1)
  Top 0.203: C7_2.1 57.78,50.48 60.01,50.48 60.96,51.44 65.11,51.44 65.94,50.61 65.94,30.45 72.65,23.75 U3.12
  Top 1.016: RC7_2.1 56.83,51.44 C7_2.1 57.47,51.44 v59.05,51.44 | C8_2.2 57.47,55.24 v59.05,55.24
  Bottom 1.016: v59.05,51.44 v59.05,55.24
C8_2  (via drill 0.55 pad 1.1)
  Top 0.203: C8_2.1 57.78,56.83 60.01,56.83 60.96,57.78 66.03,57.78 66.85,56.96 66.85,30.83 72.94,24.75 | U3.10 72.94,24.75 | 72.94,24.75
  Top 1.016: RC8_2.1 56.83,57.78 C8_2.1 57.47,57.78 v59.05,57.78
  Top 1.27: C9_2.2 57.47,61.59 v59.05,61.59
  Bottom 1.016: v59.05,57.78 v59.05,61.59
C9_2  (via drill 0.55 pad 1.1)
  Top 0.203: C9_2.1 57.78,63.18 60.01,63.18 60.96,64.14 67.02,64.14 67.84,63.31 67.84,31.14 73.23,25.75 U3.8
  Top 1.016: RC9_2.1 56.83,64.14 C9_2.1 57.47,64.14 v59.05,64.14 | C10_2.2 57.47,67.94 v59.05,67.94
  Bottom 1.016: v59.05,64.14 v59.05,67.94
C10_2  (via drill 0.55 pad 1.1)
  Top 0.203: C10_2.1 57.78,69.53 60.01,69.53 60.96,70.48 67.49,70.48 68.76,69.22 68.76,31.51 73.53,26.75 U3.6
  Top 1.016: RC10_2.1 56.83,70.48 C10_2.1 57.47,70.48 v59.05,70.48
  Top 1.27: C11_2.2 57.47,74.61 57.78,74.3 v59.05,74.3
  Bottom 1.016: v59.05,70.48 v59.05,74.3
C11_2  (via drill 0.55 pad 1.1)
  Top 0.203: C11_2.1 57.78,75.88 60.01,75.88 60.96,76.83 68.92,76.83 69.75,76.01 69.75,31.82 73.82,27.75 U3.4
  Top 1.016: RC11_2.1 56.83,76.83 C11_2.1 57.47,76.83 v59.05,76.83 | C12_2.2 57.47,80.64 v59.05,80.64
  Bottom 1.016: v59.05,76.83 v59.05,80.64
C12_2
  Top 0.203: C12_2.1 57.78,82.23 60.01,82.23 60.96,83.19 69.84,83.19 70.66,82.36 70.66,32.2 74.11,28.75 U3.2
  Top 1.016: RC12_2.1 56.83,83.19 C12_2.1
C_IN0_2  (via drill 0.55 pad 1.1)
  Top 0.203: RL1_2.1 36.39,9.97 38.37,7.99 L2.1 47.9,7.99 48.26,7.62 R30.2
  Top 1.27: MOLEX_SL_70553-0013_14PIN2.1 15.88,34.92 17.78,33.02 17.78,14.61 20.4,11.99 26.04,11.99 | 26.04,11.99 28.5,11.99 v28.57,12.06 28.65,11.99 RL1_2.1 | D3.A 26.04,11.99
  other vias: 27.3,12.06
  pour Bottom (no thermals): 30.35,10.21 30.35,14.02 17.02,14.02 17.02,10.21
C_IN1_2  (via drill 0.55 pad 1.1)
  Top 1.016: RC1_2.2 49.55,13.26 T1_25.C 47.01,15.16 37.97,15.16 36.39,16.75 RL2_2.1
  Top 1.27: RL2_2.1 v27.3,18.41 27.18,18.28 D3.C 25.39,17.78 22.23,17.78 19.68,20.32 19.68,35.56 17.78,37.47 MOLEX_SL_70553-0013_14PIN2.2
  Bottom 1.27: v27.3,18.41 RB2_2.2
  other vias: 28.57,18.41
  pour Bottom (no thermals): 30.35,20.37 17.02,20.37 17.02,16.56 30.35,16.56
C_IN2_2  (via drill 0.55 pad 1.1)
  Top 1.016: RC2_2.2 49.55,19.61 T1_26.C 47.01,21.51 37.97,21.51 36.52,22.97 RL3_2.1
  Top 1.27: MOLEX_SL_70553-0013_14PIN2.3 19.68,40.01 21.59,38.1 21.59,27.94 24.77,24.77 v27.3,24.77 RL3_2.1
  other vias: 28.57,24.77
  pour Bottom (no thermals): 30.48,22.99 30.48,26.8 17.14,26.8 17.14,22.99
C_IN3_2  (via drill 0.55 pad 1.1)
  Top 1.016: RC3_2.2 49.68,26.04 T1_27.C 47.13,27.94 38.1,27.94 36.52,29.52 RL4_2.1
  Top 1.27: MOLEX_SL_70553-0013_14PIN2.4 21.59,42.55 23.5,40.64 23.5,33.66 26.04,31.11 v27.3,31.11 RL4_2.1
  other vias: 28.57,31.11
  pour Bottom (no thermals): 30.48,33.15 17.14,33.15 17.14,29.34 30.48,29.34
C_IN4_2  (via drill 0.55 pad 1.1)
  Top 1.016: RC4_2.2 49.68,32.38 T1_28.C 47.13,34.29 38.1,34.29 36.52,35.88 RL5_2.1
  Top 1.27: MOLEX_SL_70553-0013_14PIN2.5 23.5,45.09 25.4,43.18 25.4,39.37 v27.3,37.47 RL5_2.1
  other vias: 28.57,37.47
  pour Bottom (no thermals): 30.48,35.69 30.48,39.5 17.14,39.5 17.14,35.69
C_IN5_2  (via drill 0.55 pad 1.1)
  Top 1.016: RC5_2.2 49.68,38.73 T1_29.C 47.13,40.64 38.1,40.64 36.52,42.23 RL6_2.1
  Top 1.27: MOLEX_SL_70553-0013_14PIN2.6 25.4,47.62 27.3,45.72 v27.3,43.81 RL6_2.1
  other vias: 28.57,43.81
  pour Bottom (no thermals): 30.48,45.85 17.14,45.85 17.14,42.04 30.48,42.04
C_IN6_2  (via drill 0.55 pad 1.1)
  Top 1.016: RC6_2.2 49.68,45.09 T1_30.C 47.13,46.99 38.1,46.99 36.52,48.58 RL7_2.1
  Top 1.27: MOLEX_SL_70553-0013_14PIN2.7 v28.57,50.16 RL7_2.1
  other vias: 27.3,50.16
  pour Bottom (no thermals): 30.48,48.39 30.48,52.2 17.14,52.2 17.14,48.39
C_IN7_2  (via drill 0.55 pad 1.1)
  Top 1.016: RC7_2.2 49.68,51.44 T1_31.C 47.13,53.34 38.1,53.34 36.52,54.92 RL8_2.1
  Top 1.27: MOLEX_SL_70553-0013_14PIN2.8 25.4,52.7 27.3,54.61 27.3,55.24 v28.57,56.52 RL8_2.1
  other vias: 27.94,55.88
  pour Bottom (no thermals): 30.48,58.55 17.14,58.55 17.14,54.74 30.48,54.74
C_IN8_2  (via drill 0.55 pad 1.1)
  Top 1.016: RC8_2.2 49.68,57.78 T1_32.C 47.13,59.69 38.1,59.69 36.52,61.27 RL9_2.1
  Top 1.27: MOLEX_SL_70553-0013_14PIN2.9 23.5,55.24 25.4,57.15 25.4,59.69 v28.57,62.87 RL9_2.1
  other vias: 27.94,62.23
  pour Bottom (no thermals): 30.48,61.09 30.48,64.9 17.14,64.9 17.14,61.09
C_IN9_2  (via drill 0.55 pad 1.1)
  Top 1.016: RC9_2.2 49.68,64.14 T1_33.C 47.13,66.04 38.1,66.04 36.52,67.62 RL10_2.1
  Top 1.27: MOLEX_SL_70553-0013_14PIN2.10 21.59,57.78 23.5,59.69 23.5,67.31 25.4,69.22 v27.3,69.22 RL10_2.1
  other vias: 28.57,69.22
  pour Bottom (no thermals): 30.48,71.25 17.14,71.25 17.14,67.44 30.48,67.44
C_IN10_2  (via drill 0.55 pad 1.1)
  Top 1.016: RC10_2.2 49.68,70.48 T1_34.C 47.13,72.39 38.1,72.39 36.52,73.97 RL11_2.1
  Top 1.27: RL11_2.1 v27.3,75.56 22.23,75.56 21.59,74.93 21.59,62.23 19.68,60.33 MOLEX_SL_70553-0013_14PIN2.11
  Bottom 1.27: v27.3,75.56 RB11_2.2
  other vias: 28.57,75.56
  pour Bottom (no thermals): 30.48,73.79 30.48,77.6 17.14,77.6 17.14,73.79
C_IN11_2  (via drill 0.55 pad 1.1)
  Top 1.016: RC11_2.2 49.68,76.83 T1_35.C 47.13,78.74 38.1,78.74 36.52,80.33 RL12_2.1
  Top 1.27: MOLEX_SL_70553-0013_14PIN2.12 17.78,62.87 19.68,64.77 19.68,81.28 20.32,81.92 v27.3,81.92 RL12_2.1
  other vias: 28.57,81.92
  pour Bottom (no thermals): 30.48,83.95 17.14,83.95 17.14,80.14 30.48,80.14
C_IN12_2
  Top 0.203: R24.2 72.71,40.95 71.07,42.6 71.07,82.53 69.22,84.38 69.22,84.45 68.58,85.09 53.34,85.09 52.39,84.14 RC12_2.2
  Top 0.254: R23.2 R24.2
  Top 1.016: RC12_2.2 49.68,83.19 T1_36.C 46.5,85.72
  Top 1.27: 46.5,85.72 18.41,85.72 17.78,85.09 17.78,67.31 15.88,65.41 MOLEX_SL_70553-0013_14PIN2.13
DRIVE_2
  Top 0.254: U3.38 86.88,24.25 88.27,22.86 93.34,22.86 93.98,22.23 93.98,17.14 94.61,16.51 94.61,15.27 DZT5551-2.B
GPIO1  (via drill 0.55 pad 1.1)
  Top 0.254: U3.27 83.48,18.75 86.35,15.88 v89.53,15.88 | RT1.P$2 92.08,38.1 92.71,37.47 MOLEX_SL_70553-0001_2PIN_2.1
  Bottom 0.254: v89.53,15.88 90.81,15.88 92.08,17.14 92.08,36.83 92.71,37.47 MOLEX_SL_70553-0001_2PIN_2.1
GPIO2  (via drill 0.55 pad 1.1)
  Top 0.254: U3.28 84.26,19.25 86.36,17.14 v88.9,17.14 | RT2.P$2 92.08,46.35 92.71,45.72 MOLEX_SL_70553-0001_2PIN_3.1
  Bottom 0.254: v88.9,17.14 90.17,17.14 91.44,18.41 91.44,45.09 92.08,45.72 MOLEX_SL_70553-0001_2PIN_3.1
GPIO3  (via drill 0.55 pad 1.1)
  Top 0.254: v88.27,18.41 86.36,18.41 86.36,18.43 85.04,19.75 U3.29 | RT3.P$2 92.08,54.61 92.71,53.98 MOLEX_SL_70553-0001_2PIN_4.1
  Bottom 0.254: v88.27,18.41 89.53,18.41 90.81,19.68 90.81,53.34 91.44,53.98 MOLEX_SL_70553-0001_2PIN_4.1
GPIO4  (via drill 0.55 pad 1.1)
  Top 0.254: U3.32 84.8,21.25 86.36,19.68 v87.63,19.68
  Bottom 0.254: v87.63,19.68 88.9,19.68 90.17,20.95 90.17,61.59 90.81,62.23 MOLEX_SL_70553-0002_3PIN.2
IBIAS_2
  Top 0.254: U3.45 81.01,27.75 80.73,28.02 80.73,34.7 R21.2
ICMP_2
  Top 0.254: R22.2 R21.1 | 85.09,40.64 85.72,40.01 85.72,36.83 81.28,32.38 81.28,28.51 81.51,28.29 82.24,28.29 U3.46
  Top 0.305: 85.09,40.64 R21.1
IMA_2
  Top 0.254: U3.41 88.46,25.75 88.82,26.11 88.9,48.26 88.27,48.9 84.96,48.9 83.82,50.04 83.82,57.47 R29.1 84.14,60.01 85.09,60.96 85.09,67.31 84.45,67.94 76.2,67.94 75.56,68.58 75.56,70.64 U$3.12
IMA_2_IN
  Top 0.254: U$3.1 93.98,71.75 94.61,71.12 MOLEX_SL_70553-0001_2PIN_1.2
IMB_2
  Top 0.254: U3.47 87.17,28.75 87.63,29.21 87.63,45.72 87,46.35 78.74,46.35 77.47,47.62 77.47,57.15 | R26.1 77.78,60.01 78.74,60.96 78.74,65.41 78.11,66.04 74.3,66.04 73.66,66.67 73.66,77.47 73.94,77.75 U$3.9
  Top 0.305: R26.1 77.47,57.15
IMB_2_OUT
  Top 0.254: U$3.4 94.27,77.75 94.61,78.11 MOLEX_SL_70553-0001_2PIN_0.2
IPA_2
  Top 0.254: U3.42 87.84,26.25 88.27,26.67 88.27,47.62 87.63,48.26 83.31,48.26 81.92,49.66 81.92,57.47 R29.2 82.23,60.01 80.64,61.59 80.64,66.04 80.01,66.67 74.93,66.67 74.3,67.31 74.3,74.93 75.12,75.75 U$3.10
IPA_2_IN
  Top 0.254: U$3.3 91.16,75.56 93.98,75.56 94.61,74.93 MOLEX_SL_70553-0001_2PIN_1.1
IPB_2
  Top 0.254: U3.48 86.33,29.25 87,29.91 87,45.09 86.36,45.72 77.47,45.72 75.89,47.3 R26.2 75.89,60.01 72.39,63.5 72.39,81.28 72.86,81.75 U$3.7
IPB_2_OUT
  Top 0.254: U$3.6 94.14,81.75 MOLEX_SL_70553-0001_2PIN_0.1
N$85
  Top 0.254: C17.1 75.25,37.46 75.25,35.56 | 75.2,34.34 U3.1
  Top 0.305: 75.25,35.56 R23.1 75.2,34.34
N$86
  Top 0.254: C22.1 76.83,65.08 76.2,65.41 73.66,65.41 73.03,66.04 73.03,79.38 73.41,79.75 U$3.8
N$89
  Top 0.254: U$3.11 75.66,73.75 74.93,73.03 74.93,67.94 75.56,67.31 82.55,67.31 83.19,66.67 C23.1
N$90  (via drill 0.55 pad 1.1)
  Top 1.27: LED1_25.2 v44.45,11.99 T1_25.E
  Bottom 1.27: v44.45,11.99 RB1_2.1
  other vias: 45.59,11.99
  pour Bottom (no thermals): 43.05,14.02 55.12,14.02 55.12,10.21 43.05,10.21
N$91
  Top 1.016: T1_25.G 49.55,10.72 RS1_2.2
N$92
  Top 1.016: RL1_2.2 LED1_25.1
N$93  (via drill 0.55 pad 1.1)
  Top 1.27: LED1_26.2 43.04,18.21 v44.45,18.21 46.91,18.21 T1_26.E
  Bottom 1.27: v44.45,18.21 40.83,18.21 RB2_2.1
  other vias: 45.59,18.21
  pour Bottom (no thermals): 43.05,20.37 55.12,20.37 55.12,16.56 43.05,16.56
N$94
  Top 1.016: T1_26.G 49.55,17.07 RS2_2.2
N$95
  Top 1.016: RL2_2.2 LED1_26.1
N$97  (via drill 0.55 pad 1.1)
  Top 1.27: LED1_27.2 v44.58,24.77 T1_27.E
  Bottom 1.27: v44.58,24.77 RB3_2.1
  other vias: 45.72,24.77
  pour Bottom (no thermals): 43.18,26.8 55.24,26.8 55.24,22.99 43.18,22.99
N$98
  Top 1.016: T1_27.G 49.68,23.5 RS3_2.2
N$99
  Top 1.016: RL3_2.2 LED1_27.1
N$100  (via drill 0.55 pad 1.1)
  Top 1.27: LED1_28.2 v44.58,31.11 T1_28.E
  Bottom 1.27: v44.58,31.11 RB4_2.1
  other vias: 45.72,31.11
  pour Bottom (no thermals): 43.18,33.15 55.24,33.15 55.24,29.34 43.18,29.34
N$101
  Top 1.016: T1_28.G 49.68,29.84 RS4_2.2
N$102
  Top 1.016: RL4_2.2 LED1_28.1
N$103  (via drill 0.55 pad 1.1)
  Top 1.27: LED1_29.2 v44.58,37.47 T1_29.E
  Bottom 1.27: v44.58,37.47 RB5_2.1
  other vias: 45.72,37.47
  pour Bottom (no thermals): 43.18,39.5 55.24,39.5 55.24,35.69 43.18,35.69
N$104
  Top 1.016: T1_29.G 49.68,36.2 RS5_2.2
N$105
  Top 1.016: RL5_2.2 LED1_29.1
N$106  (via drill 0.55 pad 1.1)
  Top 1.27: LED1_30.2 v44.58,43.81 T1_30.E
  Bottom 1.27: v44.58,43.81 RB6_2.1
  other vias: 45.72,43.81
  pour Bottom (no thermals): 43.18,45.85 55.24,45.85 55.24,42.04 43.18,42.04
N$107
  Top 1.016: T1_30.G 49.68,42.55 RS6_2.2
N$108
  Top 1.016: RL6_2.2 LED1_30.1
N$109  (via drill 0.55 pad 1.1)
  Top 1.27: LED1_31.2 v44.58,50.16 T1_31.E
  Bottom 1.27: v44.58,50.16 RB7_2.1
  other vias: 45.72,50.16
  pour Bottom (no thermals): 43.18,52.2 55.24,52.2 55.24,48.39 43.18,48.39
N$110
  Top 1.016: T1_31.G 49.68,48.9 RS7_2.2
N$111
  Top 1.016: RL7_2.2 LED1_31.1
N$112  (via drill 0.55 pad 1.1)
  Top 1.27: LED1_32.2 v44.58,56.52 T1_32.E
  Bottom 1.27: v44.58,56.52 RB8_2.1
  other vias: 45.72,56.52
  pour Bottom (no thermals): 43.18,58.55 55.24,58.55 55.24,54.74 43.18,54.74
N$113
  Top 1.016: T1_32.G 49.68,55.24 RS8_2.2
N$114
  Top 1.016: RL8_2.2 LED1_32.1
N$115  (via drill 0.55 pad 1.1)
  Top 1.27: LED1_33.2 v44.58,62.87 T1_33.E
  Bottom 1.27: v44.58,62.87 RB9_2.1
  other vias: 45.72,62.87
  pour Bottom (no thermals): 43.18,64.9 55.24,64.9 55.24,61.09 43.18,61.09
N$116
  Top 1.016: T1_33.G 49.68,61.59 RS9_2.2
N$117
  Top 1.016: RL9_2.2 LED1_33.1
N$118  (via drill 0.55 pad 1.1)
  Top 1.27: LED1_34.2 v44.58,69.22 T1_34.E
  Bottom 1.27: v44.58,69.22 RB10_2.1
  other vias: 45.72,69.22
  pour Bottom (no thermals): 43.18,71.25 55.24,71.25 55.24,67.44 43.18,67.44
N$119
  Top 1.016: T1_34.G 49.68,67.94 RS10_2.2
N$120
  Top 1.016: RL10_2.2 LED1_34.1
N$121  (via drill 0.55 pad 1.1)
  Top 1.27: LED1_35.2 v44.58,75.56 T1_35.E
  Bottom 1.27: v44.58,75.56 RB11_2.1
  other vias: 45.72,75.56
  pour Bottom (no thermals): 43.18,77.6 55.24,77.6 55.24,73.79 43.18,73.79
N$122
  Top 1.016: T1_35.G 49.68,74.3 RS11_2.2
N$123
  Top 1.016: RL11_2.2 LED1_35.1
N$124  (via drill 0.55 pad 1.1)
  Top 1.27: LED1_36.2 v44.58,81.92 T1_36.E
  Bottom 1.27: v44.58,81.92 RB12_2.1
  other vias: 45.72,81.92
  pour Bottom (no thermals): 43.18,83.95 55.24,83.95 55.24,80.14 43.18,80.14
N$125
  Top 1.016: T1_36.G 49.68,80.64 RS12_2.2
N$126
  Top 1.016: RL12_2.2 LED1_36.1
S1_2
  Top 0.203: RS1_2.1 54.8,10.08 55.12,10.08 55.75,9.45 59.56,9.45 60.2,10.08 60.2,11.99 60.91,12.7 69.17,12.7 70.71,14.25 70.71,16.74 71.12,17.14 72.39,17.14 73.66,15.88 81.92,15.88 82.28,16.24 U3.25
S2_2
  Top 0.203: RS2_2.1 54.8,16.43 55.12,16.43 55.75,15.8 59.56,15.8 60.2,16.43 60.2,18.34 60.91,19.05 70.55,19.05 71.27,18.32 75.12,18.32 U3.23
S3_2
  Top 0.203: RS3_2.1 54.92,22.86 55.24,22.86 55.88,22.23 59.69,22.23 60.33,22.86 60.33,24.77 60.96,25.4 65.41,25.4 71.56,19.25 U3.21
S4_2
  Top 0.203: RS4_2.1 54.92,29.21 55.24,29.21 55.88,28.57 59.69,28.57 60.33,29.21 60.33,31.11 60.96,31.75 62.23,31.75 62.87,31.11 62.87,29.21 71.83,20.25 U3.19
S5_2
  Top 0.203: RS5_2.1 54.92,35.56 55.24,35.56 55.88,34.92 59.69,34.92 60.33,35.56 60.33,37.47 60.96,38.1 63.09,38.1 63.73,37.47 63.73,29.65 72.13,21.25 U3.17
S6_2
  Top 0.203: RS6_2.1 54.92,41.91 55.24,41.91 55.88,41.27 59.69,41.27 60.33,41.91 60.33,43.81 60.96,44.45 64.14,44.45 64.54,44.04 64.54,29.98 72.3,22.23 75.18,22.23 U3.15
S7_2
  Top 0.203: RS7_2.1 54.92,48.26 55.24,48.26 55.88,47.62 59.69,47.62 60.33,48.26 60.33,50.16 60.96,50.8 64.77,50.8 65.41,50.16 65.41,30.34 72.5,23.25 U3.13
S8_2
  Top 0.203: RS8_2.1 54.92,54.61 55.24,54.61 55.88,53.98 59.69,53.98 60.33,54.61 60.33,56.52 60.96,57.15 65.76,57.15 66.4,56.52 66.4,30.64 72.79,24.25 72.8,24.25 U3.11
S9_2
  Top 0.203: RS9_2.1 54.92,60.96 55.24,60.96 55.88,60.33 59.69,60.33 60.33,60.96 60.33,62.87 60.96,63.5 66.67,63.5 67.31,62.87 67.31,31.02 73.09,25.25 | U3.9 73.09,25.25 | 73.09,25.25
S10_2
  Top 0.203: RS10_2.1 54.92,67.31 55.24,67.31 55.88,66.67 59.69,66.67 60.33,67.31 60.33,69.22 60.96,69.85 67.03,69.85 68.3,68.58 68.3,31.32 73.38,26.25 U3.7
S11_2
  Top 0.203: RS11_2.1 54.92,73.66 55.24,73.66 55.88,73.03 59.69,73.03 60.33,73.66 60.33,75.56 60.96,76.2 68.58,76.2 69.22,75.56 69.22,31.7 73.65,27.27 75.17,27.27 U3.5
S12_2
  Top 0.203: RS12_2.1 54.92,80.01 55.24,80.01 55.88,79.38 59.69,79.38 60.33,80.01 60.33,81.92 60.96,82.55 69.57,82.55 70.21,81.92 70.21,32.01 73.94,28.27 75.17,28.27 U3.3
V-_2  (via drill 0.53, 0.55 pad 1.1)
  Top 0.152: 83.22,61.88 C23.2
  Top 0.254: C17.2 v78.11,36.83 | C21.2 C20.2 C19.2 100.01,9.21 v100.33,8.89 | C18.2 102.23,15.88 102.94,15.17 v102.94,14.04
  Top 0.305: v80.64,20.32 80.72,20.25 U3.30 U3.31
  Top 0.508: R22.1 C17.2 | C22.2 v76.83,59.69 | v83.22,59.69 83.22,61.88 | L2.2 56.97,5.86 C24.2 63.91,6.04 v64.77,6.9
  pour Bottom: 62.23,85.72 83.82,85.72 83.82,67.13 106.05,67.13 106.05,5.08 62.23,5.08
VREF1_C4_2
  Top 0.254: U3.35 82.31,22.72 85.86,22.72 87,21.59 92.08,21.59 92.71,20.95 92.71,13.34 93.34,12.7 94.61,12.7 95.25,12.06 C20.1
VREF2_C5_2  (via drill 0.55 pad 1.1)
  Top 0.254: U3.34 82.31,22.22 85.09,22.22 86.36,20.95 91.44,20.95 92.08,20.32 92.08,13.97 | 101.6,48.9 v101.6,41.91 100.69,41.01 RT1.P$1 | 101.6,48.9 101.6,57.15 101.23,57.52 RT3.P$1 | 92.08,13.97 C21.1 | 92.08,13.97 91.44,14.61 v90.17,14.61 | RT2.P$1 101.23,49.26 101.6,48.9
  Bottom 0.254: v90.17,14.61 91.44,14.61 92.71,15.88 92.71,32.38 93.34,33.02 100.97,33.02 101.6,33.66 v101.6,41.91
VREG_2
  Top 0.254: U3.37 82.31,23.72 | U3.40 81.31,25.25 81.28,25.27 80.64,24.64 80.64,24 81.4,23.25 U3.36 82.31,23.27 82.31,23.72 | 82.31,23.72 86.12,23.72 87.62,22.23 92.71,22.23 93.34,21.59 93.34,13.97 93.98,13.34 97.79,13.34 | 97.79,13.34 98.42,12.7 C19.1 99.38,12.06 103.5,12.06 104.14,12.7 104.14,23.5 103.5,24.13 90.17,24.13 89.53,24.77 89.53,64.14 90.17,64.77 MOLEX_SL_70553-0002_3PIN.1 | 97.79,13.34 99.06,13.34 99.33,13.6 DZT5551-2.E
VREG_CAP_2  (via drill 0.55 pad 1.1)
  Top 0.254: 74.93,40.01 74.93,41.91 76.83,43.81 84.45,43.81 86.36,41.91 86.36,33.66 85.72,33.02 v84.45,33.02 | v88.27,24.77 88.27,24.13 88.9,23.5 94.59,23.5 DZT5551-2.C 101.49,21.06 102.23,20.32 C18.1
  Top 0.305: DZT5551-2.C@2 DZT5551-2.C | R24.1 74.93,40.01
  Bottom 0.305: v88.27,24.77 85.09,24.77 84.45,25.4 v84.45,33.02

### Text on the board
tPlace: M3 Screw | IPB | IPB | IMB | IMB | IPA | IMA | 5V | GPIO4 | V- | GPIO3 | V- | GPIO2 | V- | GPIO1 | V- | M3 Screw | WASHINGTON SUPERBIKE
tNames: HM2112ZNL PULSE | IPA | IMA | DZT5551-13 | LTC6811-1
tValues: LTC6811-1